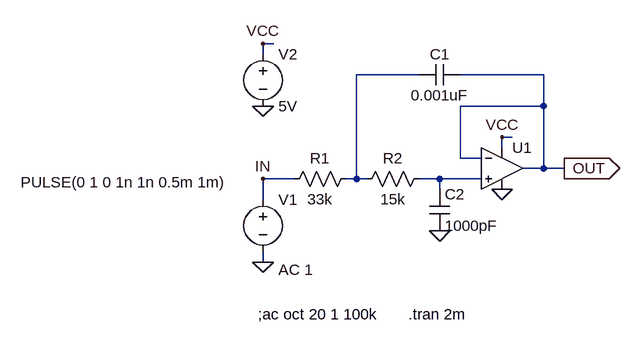
[diagram p0: schematic ArduinoLFO_VCVS_4thLPF_1stStage.asc]
ArduinoLFO_VCVS_4thLPF_1stStage.asc, the LTspice schematic file:
Version 4
SHEET 1 880 680
WIRE -128 -16 -144 -16
WIRE -144 0 -144 -16
WIRE 96 32 0 32
WIRE 288 32 160 32
WIRE 288 80 288 32
WIRE 288 80 160 80
WIRE 240 128 224 128
WIRE 224 144 224 128
WIRE 160 160 160 80
WIRE 192 160 160 160
WIRE 288 176 288 80
WIRE 288 176 256 176
WIRE 320 176 288 176
WIRE -96 192 -144 192
WIRE 0 192 0 32
WIRE 0 192 -16 192
WIRE 16 192 0 192
WIRE 128 192 96 192
WIRE 192 192 128 192
WIRE 128 208 128 192
WIRE -144 224 -144 192
WIRE -144 320 -144 304
FLAG 224 208 0
FLAG 128 272 0
FLAG 224 128 VCC
FLAG -144 320 0
FLAG 320 176 OUT
IOPIN 320 176 Out
FLAG -144 80 0
FLAG -144 -16 VCC
FLAG -144 192 IN
SYMBOL Opamps\\UniversalOpamp2 224 176 R0
SYMATTR InstName U1
SYMBOL cap 160 16 R90
WINDOW 0 0 32 VBottom 2
WINDOW 3 32 32 VTop 2
SYMATTR InstName C1
SYMATTR Value 0.001uF
SYMBOL res 0 176 R90
WINDOW 0 0 56 VBottom 2
WINDOW 3 32 56 VTop 2
SYMATTR InstName R1
SYMATTR Value 33k
SYMBOL res 112 176 R90
WINDOW 0 0 56 VBottom 2
WINDOW 3 32 56 VTop 2
SYMATTR InstName R2
SYMATTR Value 15k
SYMBOL cap 112 208 R0
SYMATTR InstName C2
SYMATTR Value 1000pF
SYMBOL voltage -144 208 R0
WINDOW 123 24 124 Left 2
WINDOW 39 0 0 Left 2
WINDOW 3 -373 -11 Left 2
SYMATTR Value2 AC 1
SYMATTR Value PULSE(0 1 0 1n 1n 0.5m 1m)
SYMATTR InstName V1
SYMBOL voltage -144 -16 R0
SYMATTR InstName V2
SYMATTR Value 5V
TEXT -152 400 Left 2 !;ac oct 20 1 100k
TEXT 80 400 Left 2 !.tran 2m

The netlist it stands for:
* ArduinoLFO_VCVS_4thLPF_1stStage.asc
XU1 N002 OUT VCC 0 OUT level.2 Avol=1Meg GBW=10Meg Slew=10Meg ilimit=25m rail=0 Vos=0 phimargin=45 en=0 enk=0 in=0 ink=0 Rin=500Meg  ; pins IN+ IN- V+ V- OUT
C1 OUT N001 0.001uF
R1 N001 IN 33k
R2 N002 N001 15k
C2 N002 0 1000pF
V1 IN 0 PULSE(0 1 0 1n 1n 0.5m 1m) AC 1
V2 VCC 0 5V
;ac oct 20 1 100k
.tran 2m
.lib UniversalOpamps2.sub
.backanno
.end